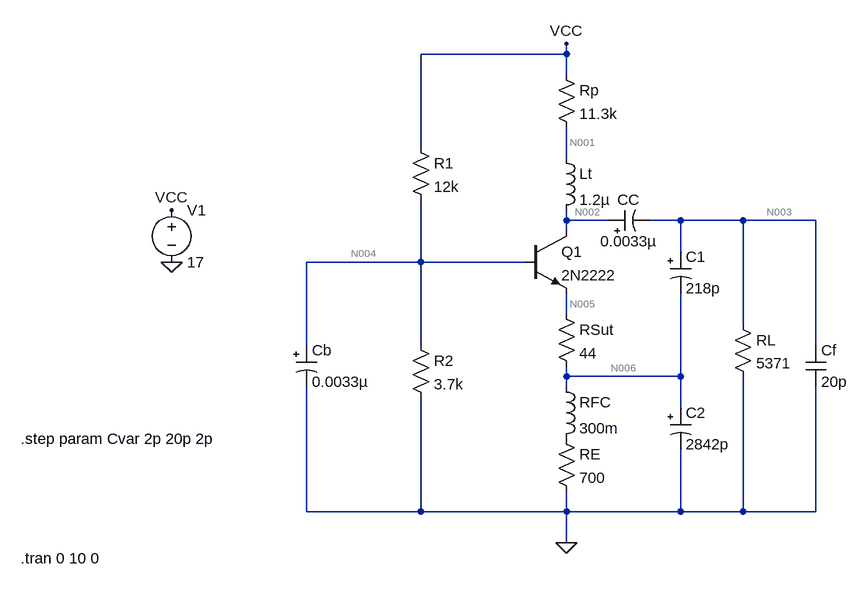
[diagram p0: schematic ColpittsOscilator.asc]
ColpittsOscilator.asc, the LTspice schematic file:
Version 4
SHEET 1 880 680
WIRE 208 -176 208 -192
WIRE 208 -176 -16 -176
WIRE 208 -144 208 -176
WIRE -16 -32 -16 -176
WIRE 208 -16 208 -64
WIRE 208 80 208 64
WIRE 272 80 208 80
WIRE 384 80 336 80
WIRE 480 80 384 80
WIRE 592 80 480 80
WIRE 208 96 208 80
WIRE 384 128 384 80
WIRE -16 144 -16 48
WIRE -16 144 -192 144
WIRE 144 144 -16 144
WIRE 208 224 208 192
WIRE 480 240 480 80
WIRE -192 272 -192 144
WIRE -16 272 -16 144
WIRE 592 272 592 80
WIRE 208 320 208 304
WIRE 384 320 384 192
WIRE 384 320 208 320
WIRE 208 336 208 320
WIRE 384 368 384 320
WIRE -192 528 -192 336
WIRE -16 528 -16 352
WIRE -16 528 -192 528
WIRE 208 528 208 496
WIRE 208 528 -16 528
WIRE 384 528 384 432
WIRE 384 528 208 528
WIRE 480 528 480 320
WIRE 480 528 384 528
WIRE 592 528 592 336
WIRE 592 528 480 528
WIRE 208 576 208 528
FLAG -400 144 0
FLAG -400 64 VCC
FLAG 208 -192 VCC
FLAG 208 576 0
SYMBOL voltage -400 48 R0
WINDOW 123 0 0 Left 0
WINDOW 39 0 0 Left 0
SYMATTR InstName V1
SYMATTR Value 17
SYMBOL res -32 -48 R0
SYMATTR InstName R1
SYMATTR Value 12k
SYMBOL ind 192 -32 R0
SYMATTR InstName Lt
SYMATTR Value 1.2µ
SYMBOL res -32 256 R0
SYMATTR InstName R2
SYMATTR Value 3.7k
SYMBOL res 192 208 R0
SYMATTR InstName RSut
SYMATTR Value 44
SYMBOL ind 192 320 R0
SYMATTR InstName RFC
SYMATTR Value 300m
SYMBOL res 192 400 R0
SYMATTR InstName RE
SYMATTR Value 700
SYMBOL res 464 224 R0
SYMATTR InstName RL
SYMATTR Value 5371
SYMBOL res 192 -160 R0
SYMATTR InstName Rp
SYMATTR Value 11.3k
SYMBOL npn 144 96 R0
SYMATTR InstName Q1
SYMATTR Value 2N2222
SYMBOL polcap 272 96 R270
WINDOW 0 32 32 VTop 2
WINDOW 3 0 32 VBottom 2
SYMATTR InstName CC
SYMATTR Value 0.0033µ
SYMBOL polcap 368 128 R0
SYMATTR InstName C1
SYMATTR Value 218p
SYMBOL polcap 368 368 R0
SYMATTR InstName C2
SYMATTR Value 2842p
SYMBOL polcap -208 272 R0
SYMATTR InstName Cb
SYMATTR Value 0.0033µ
SYMBOL cap 576 272 R0
SYMATTR InstName Cf
SYMATTR Value 20p
TEXT -632 416 Left 2 !.step param Cvar 2p 20p 2p
TEXT -632 600 Left 2 !.tran 0 10 0

The netlist it stands for:
* ColpittsOscilator.asc
V1 VCC 0 17
R1 VCC N004 12k
Lt N001 N002 1.2µ
R2 N004 0 3.7k
RSut N005 N006 44
L§RFC N006 P001 300m
RE P001 0 700
RL N003 0 5371
Rp VCC N001 11.3k
Q1 N002 N004 N005 0 2N2222
CC N002 N003 0.0033µ
C1 N003 N006 218p
C2 N006 0 2842p
Cb N004 0 0.0033µ
Cf N003 0 20p
.model NPN NPN
.model PNP PNP
.lib standard.bjt
.step param Cvar 2p 20p 2p
.tran 0 10 0
.backanno
.end

* Results of the author's LTspice run, read from the files saved beside the schematic
* Operating Point (first step), zero values left out:
*   cvar = 2 p
*   V(vcc) = 17 V
*   V(n004) = 2.274 V
*   V(n001) = 1.513 V
*   V(n002) = 1.513 V
*   V(n005) = 1.475 V
*   V(n006) = 1.388 V
*   V(p001) = 1.388 V
*   Ic(Q1) = 1.37 mA
*   Ib(Q1) = 612.6 µA
*   Ie(Q1) = -1.983 mA
*   I(Lt) = 1.37 mA
*   I(Rfc) = 1.983 mA
*   I(R1) = 1.227 mA
*   I(R2) = 614.6 µA
*   I(Rsut) = 1.983 mA
*   I(Re) = 1.983 mA
*   I(Rp) = 1.37 mA
*   I(V1) = -2.598 mA
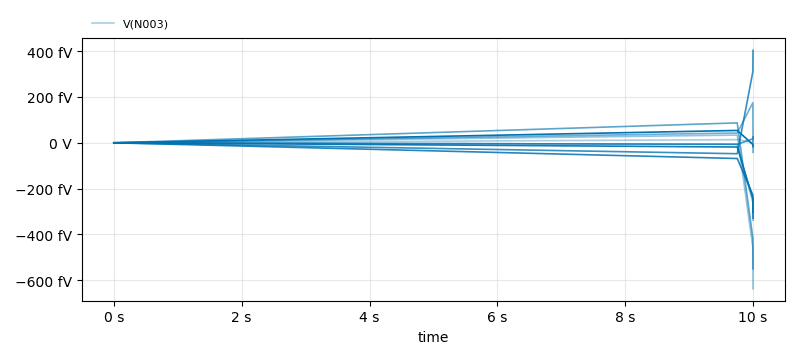
[diagram p1: Transient Analysis of ColpittsOscilator.asc, plotted from the saved traces]
* Transient Analysis, 10 runs:
*   V(N003) [cvar=2e-12]: min 0.02845 fV, max 16.15 fV, average 6.905 fV, rms 9.73 fV, last 16.15 fV
*   V(N003) [cvar=4e-12]: min -637.2 fV, max 33.78 fV, average 11.18 fV, rms 56.51 fV, last -637.2 fV
*   V(N003) [cvar=6e-12]: min -338 fV, max 0.02845 fV, average -6.475 fV, rms 29.44 fV, last -338 fV
*   V(N003) [cvar=8e-12]: min -41.42 fV, max 175 fV, average 23.55 fV, rms 35.96 fV, last -41.42 fV
*   V(N003) [cvar=1e-11]: min -550 fV, max 87.04 fV, average 38.3 fV, rms 77.27 fV, last -550 fV
*   V(N003) [cvar=1.2e-11]: min -6.567 fV, max 26.55 fV, average -3.051 fV, rms 5.037 fV, last 26.55 fV
*   V(N003) [cvar=1.4e-11]: min -47.6 fV, max 403.5 fV, average -19.89 fV, rms 48.42 fV, last 403.5 fV
*   V(N003) [cvar=1.6e-11]: min -328.9 fV, max 0.02845 fV, average -37.09 fV, rms 54.79 fV, last -328.9 fV